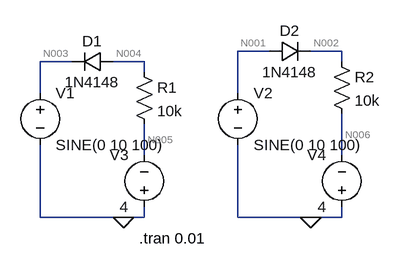
[diagram p0: schematic Draft6.asc]
Draft6.asc, the LTspice schematic file:
Version 4.1
SHEET 1 880 680
WIRE 352 16 304 16
WIRE 464 16 416 16
WIRE 48 32 0 32
WIRE 160 32 112 32
WIRE 464 32 464 16
WIRE 160 48 160 32
WIRE 0 80 0 32
WIRE 304 80 304 16
WIRE 160 176 160 128
WIRE 464 176 464 112
WIRE 0 272 0 160
WIRE 128 272 0 272
WIRE 160 272 160 256
WIRE 160 272 128 272
WIRE 304 272 304 160
WIRE 416 272 304 272
WIRE 464 272 464 256
WIRE 464 272 416 272
FLAG 128 272 0
FLAG 416 272 0
SYMBOL voltage 0 64 R0
WINDOW 123 0 0 Left 0
WINDOW 39 0 0 Left 0
SYMATTR InstName V1
SYMATTR Value SINE(0 10 100)
SYMBOL voltage 304 64 R0
WINDOW 123 0 0 Left 0
WINDOW 39 0 0 Left 0
SYMATTR InstName V2
SYMATTR Value SINE(0 10 100)
SYMBOL res 144 32 R0
SYMATTR InstName R1
SYMATTR Value 10k
SYMBOL res 448 16 R0
SYMATTR InstName R2
SYMATTR Value 10k
SYMBOL diode 112 16 R90
WINDOW 0 0 32 VBottom 2
WINDOW 3 32 32 VTop 2
SYMATTR InstName D1
SYMATTR Value 1N4148
SYMBOL diode 352 32 R270
WINDOW 0 32 32 VTop 2
WINDOW 3 0 32 VBottom 2
SYMATTR InstName D2
SYMATTR Value 1N4148
SYMBOL voltage 160 272 R180
WINDOW 0 24 96 Left 2
WINDOW 3 24 16 Left 2
WINDOW 123 0 0 Left 0
WINDOW 39 0 0 Left 0
SYMATTR InstName V3
SYMATTR Value 4
SYMBOL voltage 464 272 R180
WINDOW 0 24 96 Left 2
WINDOW 3 24 16 Left 2
WINDOW 123 0 0 Left 0
WINDOW 39 0 0 Left 0
SYMATTR InstName V4
SYMATTR Value 4
TEXT 152 304 Left 2 !.tran 0.01

The netlist it stands for:
* Draft6.asc
V1 N003 0 SINE(0 10 100)
V2 N001 0 SINE(0 10 100)
R1 N004 N005 10k
R2 N002 N006 10k
D1 N004 N003 1N4148
D2 N001 N002 1N4148
V3 0 N005 4
V4 0 N006 4
.model D D
.lib standard.dio
.tran 0.01
.backanno
.end

* Results of the author's LTspice run, read from the files saved beside the schematic
* Operating Point, zero values left out:
*   V(n002) = -536.3 mV
*   V(n004) = -4 V
*   V(n005) = -4 V
*   V(n006) = -4 V
*   I(D1) = -2.524 nA
*   I(D2) = 346.4 µA
*   I(R1) = 2.524 nA
*   I(R2) = 346.4 µA
*   I(V1) = -2.524 nA
*   I(V2) = -346.4 µA
*   I(V3) = -2.524 nA
*   I(V4) = -346.4 µA
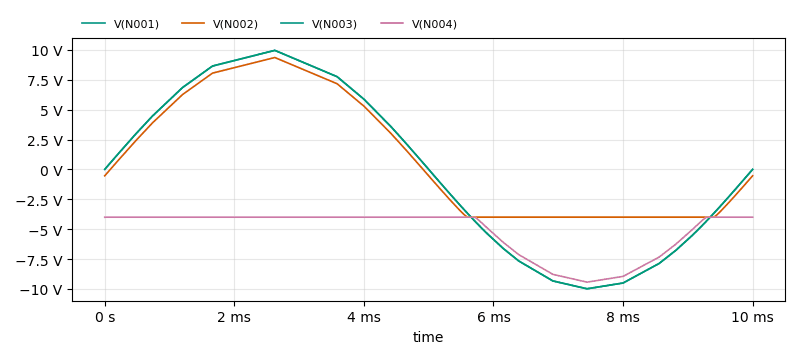
[diagram p1: Transient Analysis of Draft6.asc, plotted from the saved traces]
* Transient Analysis, 1 run:
*   V(N001): min -9.994 V, max 9.961 V, average -42.74 mV, rms 6.989 V, last 0 V
*   V(N002): min -4 V, max 9.363 V, average 1.028 V, rms 5.245 V, last -536.3 mV
*   V(N003): min -9.994 V, max 9.961 V, average -42.74 mV, rms 6.989 V, last 0 V
*   V(N004): min -9.437 V, max -4 V, average -5.231 V, rms 5.579 V, last -4 V